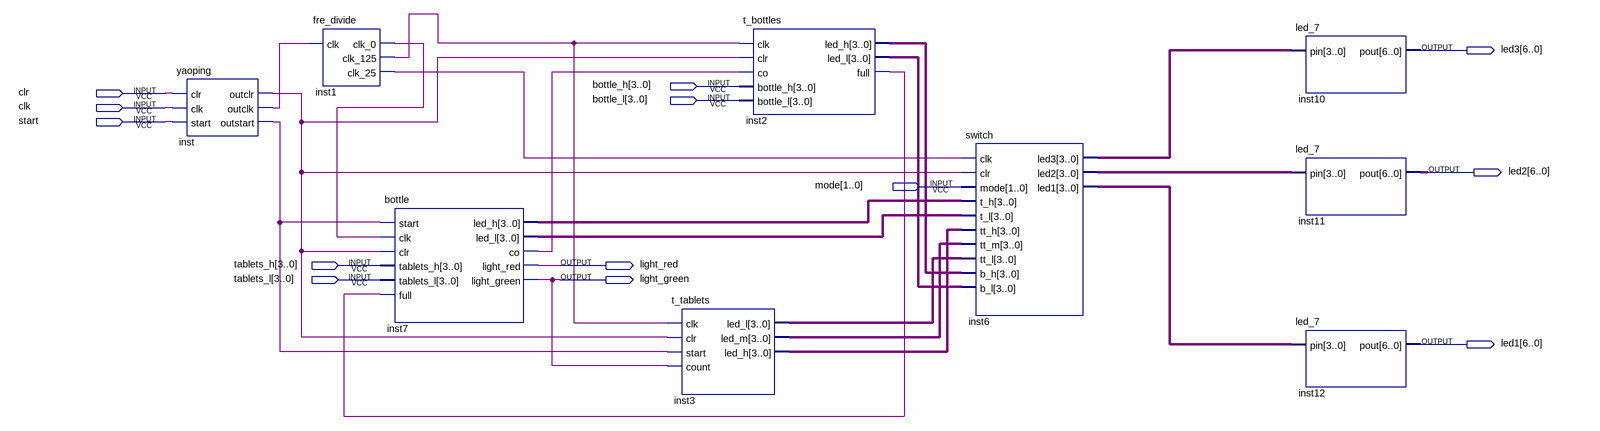
[diagram p0: schematic sheet]
// Quartus schematic Block.bdf as structural Verilog: 9 symbols, 13 pins
module Block (
  input  [3:0] bottle_h,
  input  clr,
  input  [3:0] bottle_l,
  input  clk,
  input  start,
  input  [1:0] mode,
  input  [3:0] tablets_h,
  input  [3:0] tablets_l,
  output [6:0] led3,
  output [6:0] led2,
  output light_red,
  output light_green,
  output [6:0] led1
);

  wire inst1_clk_0, inst1_clk_25, inst1_clk_125, inst2_full, inst7_co, inst_outclk, inst_outclr,
       inst_outstart;
  wire [3:0] inst2_led_h, inst2_led_l, inst3_led_h, inst3_led_l, inst3_led_m, inst6_led1, inst6_led2,
       inst6_led3, inst7_led_h, inst7_led_l;

  yaoping inst (
    .clr(clr), .clk(clk), .start(start), .outclr(inst_outclr), .outclk(inst_outclk), .outstart(inst_outstart));
  fre_divide inst1 (.clk(inst_outclk), .clk_0(inst1_clk_0), .clk_125(inst1_clk_125), .clk_25(inst1_clk_25));
  bottle inst7 (
    .start(inst_outstart), .clk(inst1_clk_0), .clr(inst_outclr), .tablets_h(tablets_h),
    .tablets_l(tablets_l), .full(inst2_full), .led_h(inst7_led_h), .led_l(inst7_led_l), .co(inst7_co),
    .light_red(light_red), .light_green(light_green));
  t_tablets inst3 (
    .clk(inst1_clk_125), .clr(inst_outclr), .start(inst_outstart), .count(light_green), .led_l(inst3_led_l),
    .led_m(inst3_led_m), .led_h(inst3_led_h));
  t_bottles inst2 (
    .clk(inst1_clk_125), .clr(inst_outclr), .co(inst7_co), .bottle_h(bottle_h), .bottle_l(bottle_l),
    .led_h(inst2_led_h), .led_l(inst2_led_l), .full(inst2_full));
  switch inst6 (
    .clk(inst1_clk_25), .clr(inst_outclr), .mode(mode), .t_h(inst7_led_h), .t_l(inst7_led_l),
    .tt_h(inst3_led_h), .tt_m(inst3_led_m), .tt_l(inst3_led_l), .b_h(inst2_led_h), .b_l(inst2_led_l),
    .led3(inst6_led3), .led2(inst6_led2), .led1(inst6_led1));
  led_7 inst10 (.pin(inst6_led3), .pout(led3));
  led_7 inst11 (.pin(inst6_led2), .pout(led2));
  led_7 inst12 (.pin(inst6_led1), .pout(led1));
endmodule
